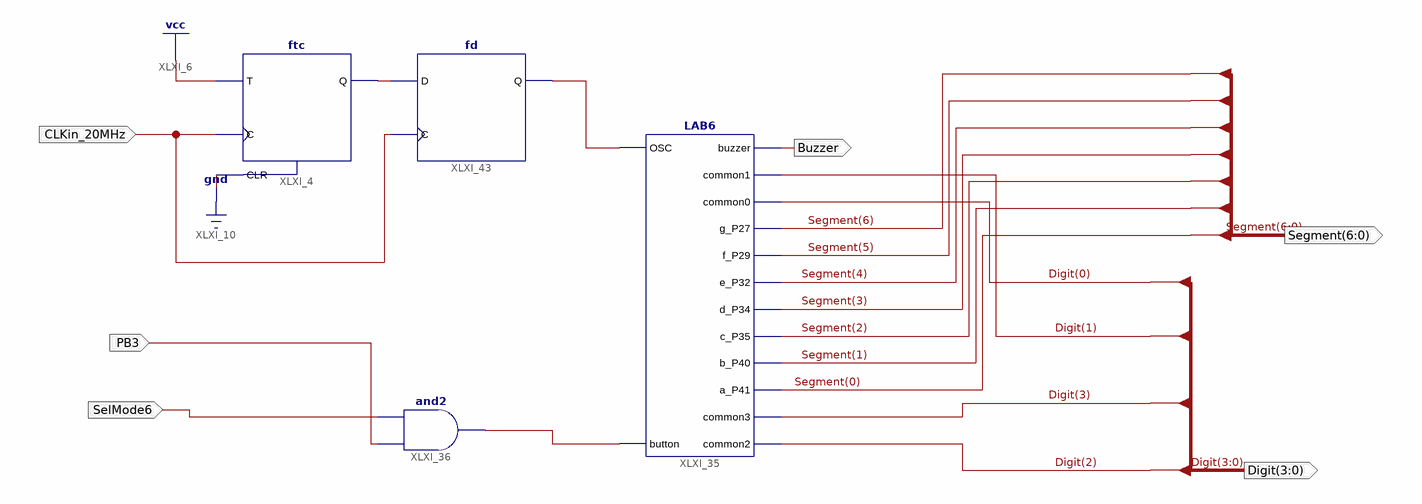
[diagram p0: schematic sheet 1]
// Xilinx ISE schematic moduleLab06.sch (spartan6) as structural Verilog: 4 symbols, 6 ports
module moduleLab06 (
  input  PB3,
  input  SelMode6,
  input  CLKin_20MHz,
  output Buzzer,
  output [6:0] Segment,
  output [3:0] Digit
);

  wire XLXN_102, XLXN_111, XLXN_112;

  LAB6 XLXI_35 (
    .OSC(XLXN_112), .button(XLXN_102), .buzzer(Buzzer), .common1(Digit[1]), .common0(Digit[0]),
    .g_P27(Segment[6]), .f_P29(Segment[5]), .e_P32(Segment[4]), .d_P34(Segment[3]), .c_P35(Segment[2]),
    .b_P40(Segment[1]), .a_P41(Segment[0]), .common3(Digit[3]), .common2(Digit[2]));
  and XLXI_36 (XLXN_102, PB3, SelMode6);
  ftc XLXI_4 (.C(CLKin_20MHz), .CLR(1'b0), .T(1'b1), .Q(XLXN_111));
  fd XLXI_43 (.C(CLKin_20MHz), .D(XLXN_111), .Q(XLXN_112));
endmodule
